# Altium project LDO_3V3.PrjPcb
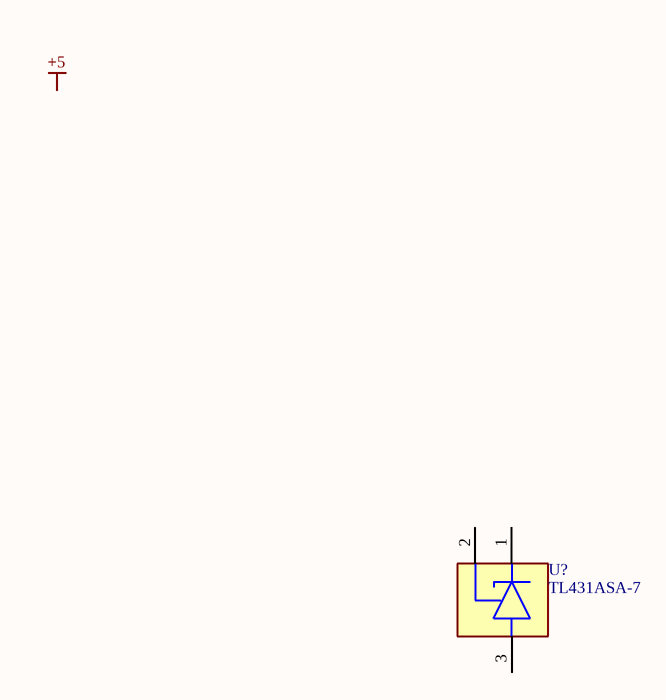
[diagram p0: LDO.SchDoc]
1 sheet, 1 parts. Net scope: global (net labels, ports and power ports of the same name join across sheets).

## Sheet LDO.SchDoc
size A; SheetNumber: 1; SheetTotal: 1

### Parts
U?  TL431ASA-7  [FP-SOT23-MFG]

### Nets

Not connected (* = marked no-connect by the designer): U? 1(C) 2(REF) 3(A)

### Notes on the sheet
- Labels drawn without touching a wire or pin: +5

### Library data of the parts
U? = CMP-12755-000001-1: IC VREF SHUNT ADJ SOT23-3; Manufacturer: DIODES INC.; Standoff Height: 0.013mm; Max Power Dissipation: 330mW; Max Junction Temp: +150°C; Output Type: AdjustableProgrammable; Description: Shunt Voltage Reference IC 36V ±1% 100mA SOT-23-3; Octopart: https://octopart.com/tl431asa-7-diodes+inc.-18832779; Automotive: No; Digikey Description: IC VREF SHUNT ADJ SOT23-3; Temperature: to +150°C; Ambient Temperature Range High: +125°C; Ipc Land Pattern Name: SOT92P240X102-3; ComponentLink2URL: https://www.diodes.com/assets/Datasheets/TL431_432.pdf; RoHS: TRUE; Manufacturer Part Number: TL431ASA-7; Reference Type: Shunt; Mouser Description: V-Ref Adjustable 2.495V to 36V 100mA 3-Pin SOT-23 T/R; Package: SOT23; Ambient Temperature Range Low: -40°C; Device Class L3: Voltage References; Temperature Range High: +150°C; ComponentLink2Description: Datasheet; Footprint Url: https://www.diodes.com/assets/Package-Files/SOT23.pdf; Category: IC; Device Class L2: Power Management ICs; Device Class L1: Integrated Circuits (ICs); Lead Free: Yes; Height: 1.1mm; Supplier: DigiKey; Supplier Part Number: TL431ASA-7DICT-ND